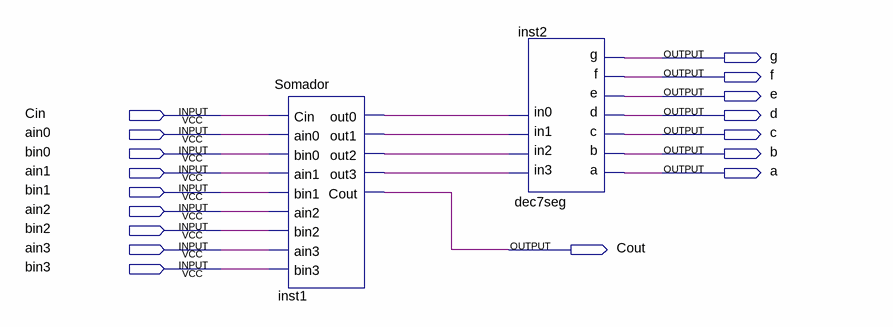
[diagram p0: schematic sheet]
// Quartus schematic SumDec.bdf as structural Verilog: 2 symbols, 17 pins
module SumDec (
  input  Cin,
  input  ain0,
  input  bin0,
  input  ain1,
  input  bin1,
  input  ain2,
  input  bin2,
  input  ain3,
  input  bin3,
  output g,
  output f,
  output e,
  output d,
  output c,
  output b,
  output a,
  output Cout
);

  wire inst1_out0, inst1_out1, inst1_out2, inst1_out3;

  Somador inst1 (
    .Cin(Cin), .ain0(ain0), .bin0(bin0), .ain1(ain1), .bin1(bin1), .ain2(ain2), .bin2(bin2), .ain3(ain3),
    .bin3(bin3), .out0(inst1_out0), .out1(inst1_out1), .out2(inst1_out2), .out3(inst1_out3), .Cout(Cout));
  dec7seg inst2 (
    .in3(inst1_out3), .in2(inst1_out2), .in1(inst1_out1), .in0(inst1_out0), .a(a), .b(b), .c(c), .d(d),
    .e(e), .f(f), .g(g));
endmodule
